# Altium project G100_PTC_RS232_201806.PrjPCB
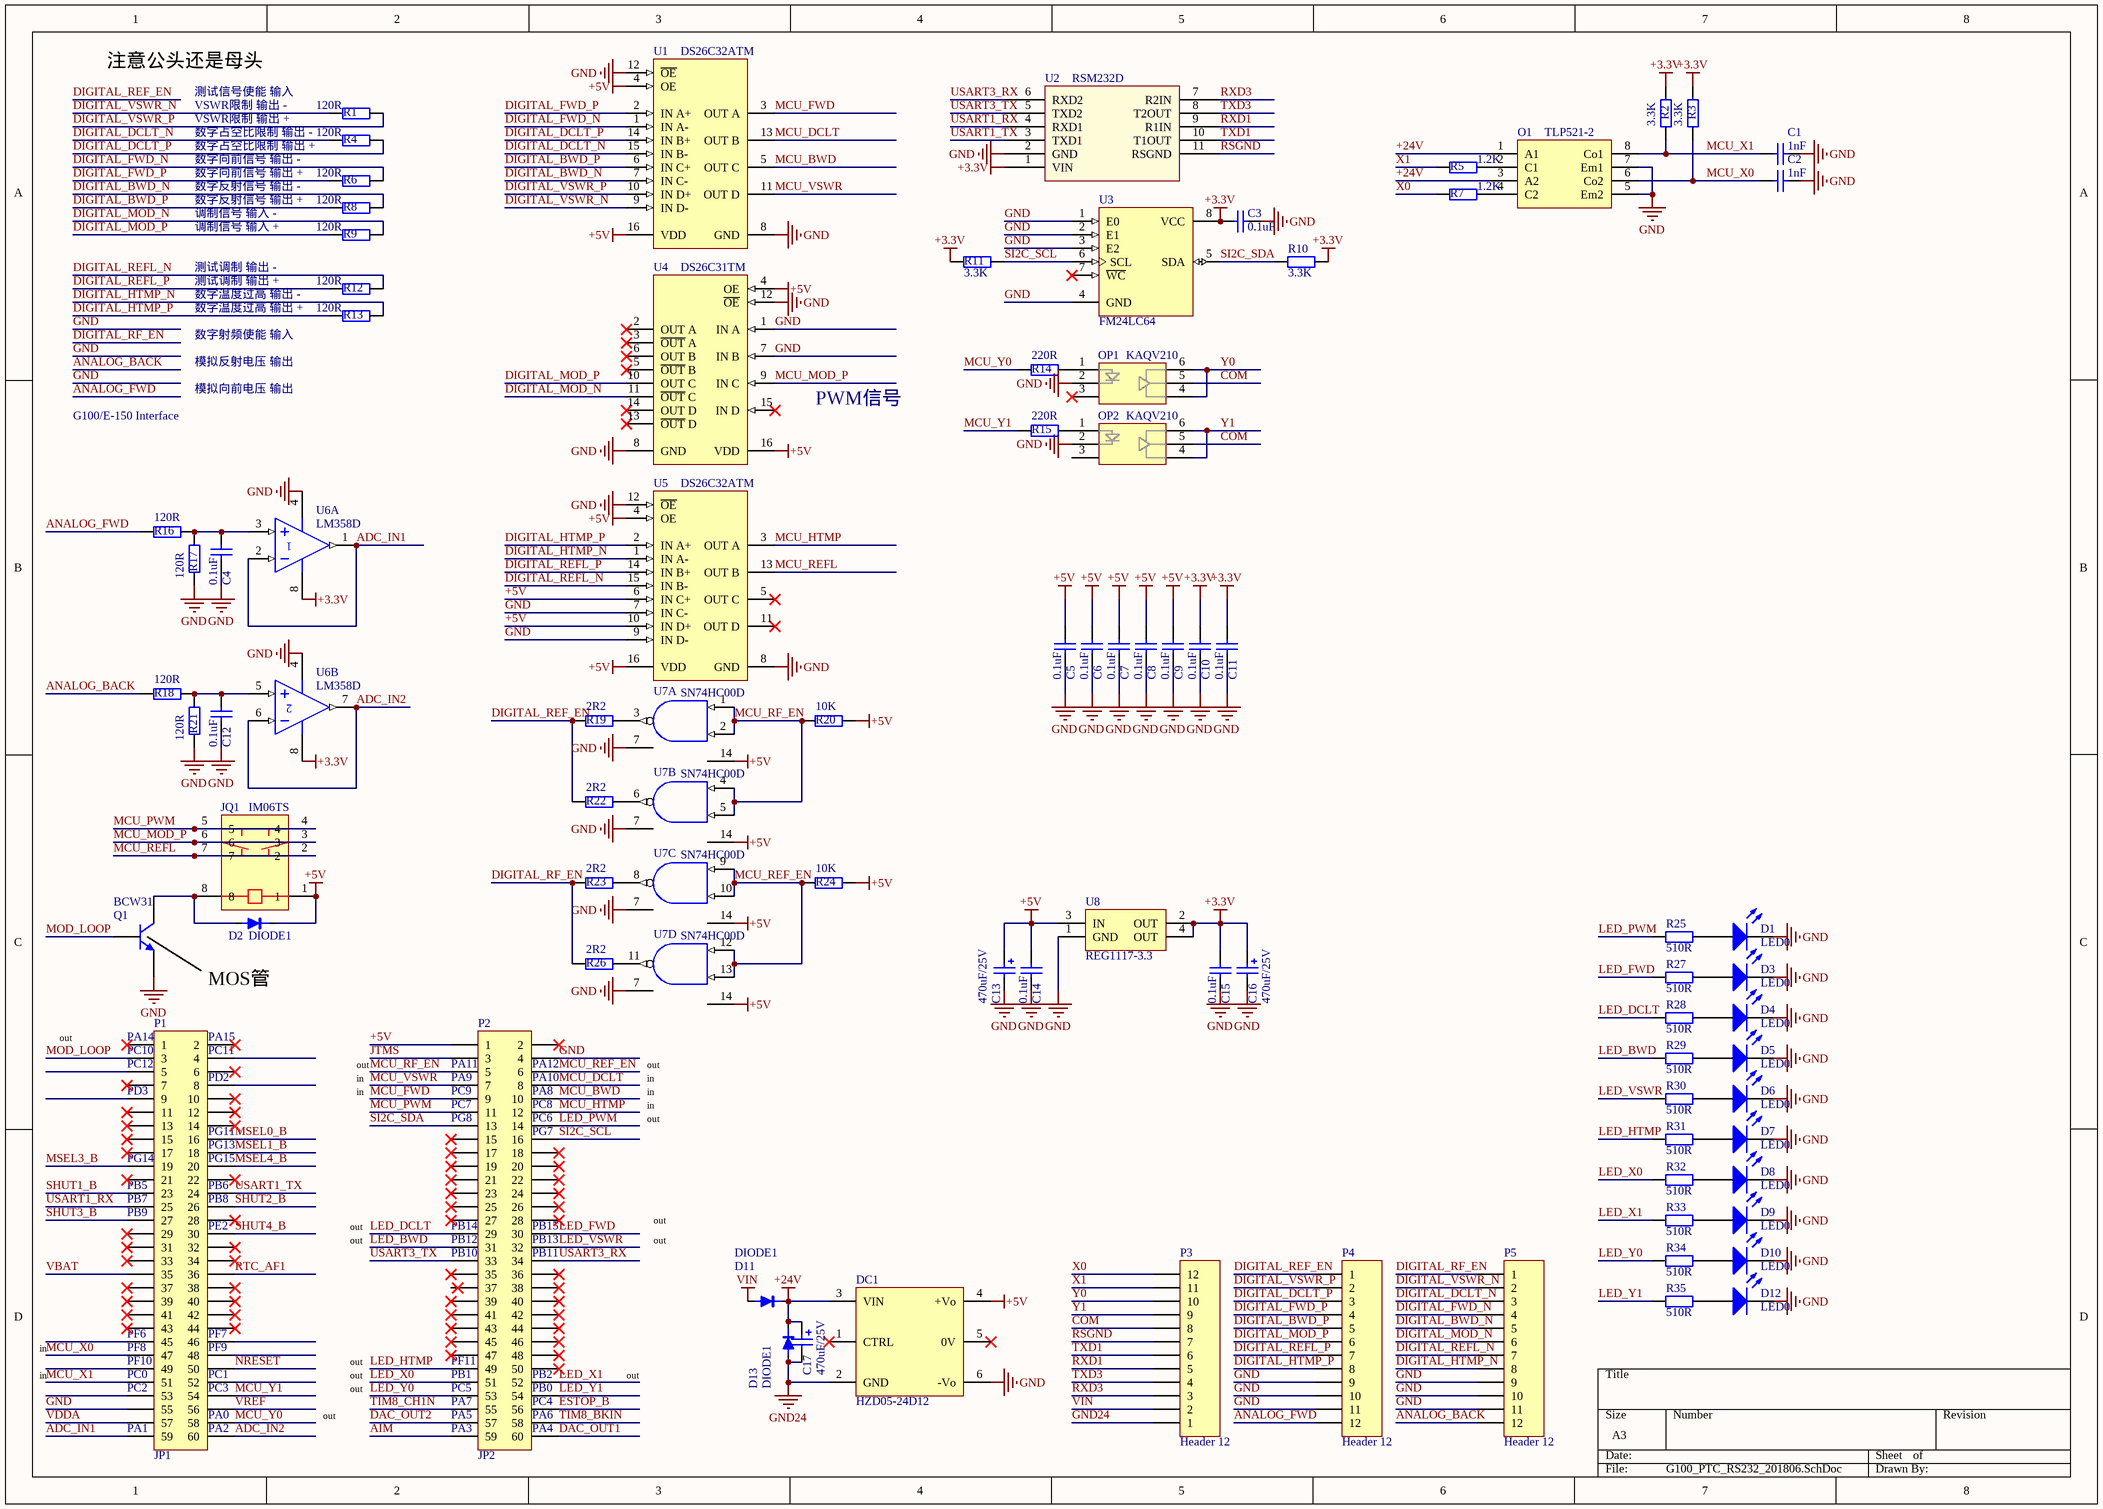
[diagram p0: G100_PTC_RS232_201806.SchDoc]
1 sheet, 84 parts. Net scope: global (net labels, ports and power ports of the same name join across sheets).
Board file: G100_PTC_RS232_201806.PcbDoc

## Sheet G100_PTC_RS232_201806.SchDoc
size A3; PageSetup: Record=PageOptions|CenterHorizontal=True|CenterVertical=True|PrintScale=1.00|XCorrection=1.00|YCorrection=1.00|PrintKind=1|BorderSize=5000000|LeftOffset=0|BottomOffset=0|Orientation=2|PaperLength=1000|PaperWidth=1000|Scale=100|PaperSource=7|PrintQuality=600|MediaType=1|DitherType=10|PaperKind=A3|PrintScaleMode=1

### Parts
C1  1nF  [0805C]
C2  1nF  [0805C]
C3  0.1uF  [0805C]
C4  0.1uF  [0805C]
C5  0.1uF  [0805C]
C6  0.1uF  [0805C]
C7  0.1uF  [0805C]
C8  0.1uF  [0805C]
C9  0.1uF  [0805C]
C10  0.1uF  [0805C]
C11  0.1uF  [0805C]
C12  0.1uF  [0805C]
C13  470uF/25V  [RB3.5-8]
C14  0.1uF  [0805C]
C15  0.1uF  [0805C]
C16  470uF/25V  [RB3.5-8]
C17  470uF/25V  [RB3.5-8]
D1  LED0  [LEDLight]
D2  DIODE1  [SOD123]
D3  LED0  [LEDLight]
D4  LED0  [LEDLight]
D5  LED0  [LEDLight]
D6  LED0  [LEDLight]
D7  LED0  [LEDLight]
D8  LED0  [LEDLight]
D9  LED0  [LEDLight]
D10  LED0  [LEDLight]
D11  DIODE1  [DIODE-DO56]
D12  LED0  [LEDLight]
D13  DIODE1  [DIODE-DO56]
DC1  HZD05-24D12  [HZ03V2]
JQ1  IM06TS  [IM06TS]
O1  TLP521-2  [DIP-8]
OP1  KAQV210  [DIP-6]
OP2  KAQV210  [DIP-6]
P1  JP1  [HDR2X30]
P2  JP2  [HDR2X30]
P3  Header 12  [15EDGVM-3.5-12P-14]
P4  Header 12  [15EDGVM-3.5-12P-14]
P5  Header 12  [15EDGVM-3.5-12P-14]
Q1  BCW31  [SOT-23A]
R1  120R  [0805C]
R2  3.3K  [0805C]
R3  3.3K  [0805C]
R4  120R  [0805C]
R5  1.2K  [6332[2512]]
R6  120R  [0805C]
R7  1.2K  [6332[2512]]
R8  120R  [0805C]
R9  120R  [0805C]
R10  3.3K  [0805C]
R11  3.3K  [0805C]
R12  120R  [0805C]
R13  120R  [0805C]
R14  220R  [0805C]
R15  220R  [0805C]
R16  120R  [0805C]
R17  120R  [0805C]
R18  120R  [0805C]
R19  2R2  [0805C]
R20  10K  [0805C]
R21  120R  [0805C]
R22  2R2  [0805C]
R23  2R2  [0805C]
R24  10K  [0805C]
R25  510R  [0805C]
R26  2R2  [0805C]
R27  510R  [0805C]
R28  510R  [0805C]
R29  510R  [0805C]
R30  510R  [0805C]
R31  510R  [0805C]
R32  510R  [0805C]
R33  510R  [0805C]
R34  510R  [0805C]
R35  510R  [0805C]
U1  DS26C32ATM  [M16A_L]
U2  RSM232D  [CTM-8251D]
U3  FM24LC64  [SOP8_L]
U4  DS26C31TM  [M16A_L]
U5  DS26C32ATM  [M16A_L]
U6  LM358D  [751-02_N]  (parts A,B of 2)
U7  SN74HC00D  [D014_N]  (parts A,B,C,D of 4)
U8  REG1117-3.3  [ZZ311]

### Nets
+3.3V: C3.2 C10.2 C11.2 C15.2 C16.1 R2.2 R3.2 R10.2 R11.2 U2.1(VIN) U3.8(VCC) U6.8(V+) U8.2(OUT) U8.4(OUT)
+5V: C5.2 C6.2 C7.2 C8.2 C9.2 C13.1 C14.2 D2.2(K) DC1.4(+Vo) JQ1.1 P2.1 R20.1 R24.1 U1.4(OE) U1.16(VDD) U4.4(OE) U4.16(VDD) U5.4(OE) U5.6(IN_C+) U5.10(IN_D+) U5.16(VDD) U7.14(VCC) U8.3(IN)  [also labelled VCC]
+24V: C17.1 D11.2(K) D13.2(K) DC1.3(VIN) O1.1(A1) O1.3(A2)
GND: C1.2 C2.2 C3.1 C4.1 C5.1 C6.1 C7.1 C8.1 C9.1 C10.1 C11.1 C12.1 C13.2 C14.1 C15.1 C16.2 D1.2(K) D3.2(K) D4.2(K) D5.2(K) D6.2(K) D7.2(K) D8.2(K) D9.2(K) D10.2(K) D12.2(K) DC1.6(-Vo) O1.5(Em2) O1.7(Em1) OP1.2 OP2.2 P1.55 P2.4 P4.9 P4.10 P4.11 P5.9 P5.10 P5.11 Q1.2(E) R17.2 R21.2 U1.8(GND) U1.12(~{OE}) U2.2(GND) U3.1(E0) U3.2(E1) U3.3(E2) U3.4(GND) U4.1(IN_A) U4.7(IN_B) U4.8(GND) U4.12(~{OE}) U5.7(IN_C-) U5.8(GND) U5.9(IN_D-) U5.12(~{OE}) U6.4(V-) U7.7(GND) U8.1(GND)
GND24: C17.2 D13.1(A) DC1.2(GND) P3.1
VIN: D11.1(A) P3.2
ADC_IN1: P1.59 U6.1(OUT) U6.2(IN-)
ADC_IN2: P1.60 U6.6(IN-) U6.7(OUT)
AIM: P2.59
ANALOG_BACK: P5.12 R18.2
ANALOG_FWD: P4.12 R16.2
COM: OP1.5 OP2.5 P3.8
DAC_OUT1: P2.60
DAC_OUT2: P2.57
DIGITAL_BWD_N: P5.5 R8.1 U1.7(IN_C-)
DIGITAL_BWD_P: P4.5 R8.2 U1.6(IN_C+)
DIGITAL_DCLT_N: P5.3 R4.2 U1.15(IN_B-)
DIGITAL_DCLT_P: P4.3 R4.1 U1.14(IN_B+)
DIGITAL_FWD_N: P5.4 R6.1 U1.1(IN_A-)
DIGITAL_FWD_P: P4.4 R6.2 U1.2(IN_A+)
DIGITAL_HTMP_N: P5.8 R13.1 U5.1(IN_A-)
DIGITAL_HTMP_P: P4.8 R13.2 U5.2(IN_A+)
DIGITAL_MOD_N: P5.6 R9.1 U4.11(~{OUT}_C)
DIGITAL_MOD_P: P4.6 R9.2 U4.10(OUT_C)
DIGITAL_REF_EN: P4.1 R19.2 R22.2
DIGITAL_REFL_N: P5.7 R12.1 U5.15(IN_B-)
DIGITAL_REFL_P: P4.7 R12.2 U5.14(IN_B+)
DIGITAL_RF_EN: P5.1 R23.2 R26.2
DIGITAL_VSWR_N: P5.2 R1.2 U1.9(IN_D-)
DIGITAL_VSWR_P: P4.2 R1.1 U1.10(IN_D+)
ESTOP_B: P2.56
JTMS: P2.3
LED_BWD: P2.31 R29.1
LED_DCLT: P2.29 R28.1
LED_FWD: P2.30 R27.1
LED_HTMP: P2.49 R31.1
LED_PWM: P2.14 R25.1
LED_VSWR: P2.32 R30.1
LED_X0: P2.51 R32.1
LED_X1: P2.52 R33.1
LED_Y0: P2.53 R34.1
LED_Y1: P2.54 R35.1
MCU_BWD: P2.10 U1.5(OUT_C)
MCU_DCLT: P2.8 U1.13(OUT_B)
MCU_FWD: P2.9 U1.3(OUT_A)
MCU_HTMP: P2.12 U5.3(OUT_A)
MCU_MOD_P: JQ1.3 JQ1.6 U4.9(IN_C)
MCU_PWM: JQ1.4 JQ1.5 P2.11
MCU_REF_EN: P2.6 R24.2 U7.9(A) U7.10(B) U7.12(A) U7.13(B)
MCU_REFL: JQ1.2 JQ1.7 U5.13(OUT_B)
MCU_RF_EN: P2.5 R20.2 U7.1(A) U7.2(B) U7.4(A) U7.5(B)
MCU_VSWR: P2.7 U1.11(OUT_D)
MCU_X0: C2.1 O1.6(Co2) P1.47 R3.1
MCU_X1: C1.1 O1.8(Co1) P1.51 R2.1
MCU_Y0: P1.58 R14.2
MCU_Y1: P1.54 R15.2
MOD_LOOP: P1.3 Q1.1(B)
MSEL0_B: P1.16
MSEL1_B: P1.18
MSEL3_B: P1.19
MSEL4_B: P1.20
NRESET: P1.50
RSGND: P3.7 U2.11(RSGND)
RTC_AF1: P1.36
RXD1: P3.5 U2.9(R1IN)
RXD3: P3.3 U2.7(R2IN)
SHUT1_B: P1.23
SHUT2_B: P1.26
SHUT3_B: P1.27
SHUT4_B: P1.30
SI2C_SCL: P2.16 R11.1 U3.6(SCL)
SI2C_SDA: P2.13 R10.1 U3.5(SDA)
TIM8_BKIN: P2.58
TIM8_CH1N: P2.55
TXD1: P3.6 U2.10(T1OUT)
TXD3: P3.4 U2.8(T2OUT)
USART1_RX: P1.25 U2.4(RXD1)
USART1_TX: P1.24 U2.3(TXD1)
USART3_RX: P2.34 U2.6(RXD2)
USART3_TX: P2.33 U2.5(TXD2)
VBAT: P1.35
VDDA: P1.57
VREF: P1.56
X0: P3.12 R7.1
X1: P3.11 R5.1
Y0: OP1.4 OP1.6 P3.10
Y1: OP2.4 OP2.6 P3.9
NetC4_2: C4.2 R16.1 R17.1 U6.3(IN+)
NetC12_2: C12.2 R18.1 R21.1 U6.5(IN+)
NetD1_1: D1.1(A) R25.2
NetD2_1: D2.1(A) JQ1.8 Q1.3(C)
NetD3_1: D3.1(A) R27.2
NetD4_1: D4.1(A) R28.2
NetD5_1: D5.1(A) R29.2
NetD6_1: D6.1(A) R30.2
NetD7_1: D7.1(A) R31.2
NetD8_1: D8.1(A) R32.2
NetD9_1: D9.1(A) R33.2
NetD10_1: D10.1(A) R34.2
NetD12_1: D12.1(A) R35.2
NetO1_2: O1.2(C1) R5.2
NetO1_4: O1.4(C2) R7.2
NetOP1_1: OP1.1 R14.1
NetOP2_1: OP2.1 R15.1
NetR19_1: R19.1 U7.3(Y)
NetR22_1: R22.1 U7.6(Y)
NetR23_1: R23.1 U7.8(Y)
NetR26_1: R26.1 U7.11(Y)

Not connected (* = marked no-connect by the designer): DC1 1(CTRL)* 5(0V)*; OP1 3*; OP2 3; P1 1* 2* 4 5 6* 7* 8 9 10* 11* 12* 13* 14* 15* 17* 21* 22* 28* 29* 31* 32* 33* 34* 37* 38* 39* 40* 41* 42* 43* 44* 45 46 48 49 52 53; P2 2* 15* 17* 18* 19* 20* 21* 22* 23* 24* 25* 26* 27* 28* 35* 36* 37 38* 39* 40* 41* 42* 43* 44* 45* 46* 47* 48* 50*; U3 7(~{WC})*; U4 2(OUT_A)* 3(~{OUT}_A)* 5(~{OUT}_B)* 6(OUT_B)* 13(~{OUT}_D)* 14(OUT_D)* 15(IN_D)*; U5 5(OUT_C)* 11(OUT_D)*

### Notes on the sheet
- 注意公头还是母头
- VSWR限制 输出 -
- 测试信号使能 输入
- 数字向前信号 输出 +
- 数字向前信号 输出 -
- 数字占空比限制 输出 +
- 数字占空比限制 输出 -
- VSWR限制 输出 +
- 调制信号 输入 +
- 调制信号 输入 -
- 数字反射信号 输出 +
- 数字反射信号 输出 -
- 数字温度过高 输出 +
- 数字温度过高 输出 -
- 测试调制 输出 +
- 测试调制 输出 -
- 模拟反射电压 输出
- 数字射频使能 输入
- G100/E-150 Interface
- 模拟向前电压 输出
- PWM信号
- MOS管
- out
- (near P1) PC10
- (near P1) PA14
- (near P1) PC11
- (near P1) PA15
- (near P1) PC12
- (near P1) PD3
- (near P1) PD2
- in
- (near P2) PA9
- (near P2) PC7
- (near P2) PC9
- (near P2) PG8
- (near P2) PA11
- (near P2) PA8
- (near P2) PA10
- (near P2) PC6
- (near P2) PC8
- (near P2) PA12
- (near P1) PG14
- (near P1) PB5
- (near P1) PB6
- (near P1) PG11
- (near P1) PG13
- (near P1) PG15
- (near P2) PG7
- (near P1) PB7
- (near P1) PB9
- (near P1) PB8
- (near P1) PE2
- (near P2) PB14
- (near P2) PB12
- (near P2) PB10
- (near P2) PB13
- (near P2) PB15
- (near P2) PB11
- (near P1) PF6
- (near P1) PF8
- (near P1) PF10
- (near P1) PC0
- (near P1) PC2
- (near P1) PF7
- (near P1) PF9
- (near P1) PC1
- (near P1) PC3
- (near P2) PB1
- (near P2) PC5
- (near P2) PF11
- (near P2) PB0
- (near P2) PB2
- (near P1) PA1
- (near P1) PA0
- (near P1) PA2
- (near P2) PA7
- (near P2) PA5
- (near P2) PA3
- (near P2) PA6
- (near P2) PA4
- (near P2) PC4

### Library data of the parts
C1-C3 = Cap: Capacitor; Value: 100pF; Published: 8-Jun-2000; LatestRevisionDate: 17-Jul-2002; LatestRevisionNote: Re-released for DXP Platform.; PackageReference: RAD-0.3; Publisher: Altium Limited
C4-C12 C14 C15 = Cap: Capacitor; Value: 0.01uF; Published: 8-Jun-2000; LatestRevisionDate: 17-Jul-2002; LatestRevisionNote: Re-released for DXP Platform.; PackageReference: RAD-0.3; Publisher: Altium Limited
C13 C16 C17 = Cap Pol2: Polarized Capacitor (Axial); Value: 100pF; Published: 8-Jun-2000; LatestRevisionDate: 17-Jul-2002; LatestRevisionNote: Re-released for DXP Platform.; PackageReference: POLAR0.8; Publisher: Altium Limited
D1 D3-D10 D12 = LED0: Typical INFRARED GaAs LED; Published: 8-Jun-2000; LatestRevisionDate: 08-Jul-2005; LatestRevisionNote: Mech Layer 1 removed.; PackageReference: LED-0; Publisher: Altium Limited
O1 = TLP521-2: Photocoupler
P1 P2 = Header 30X2: Header, 30-Pin, Dual row; LatestRevisionDate: 17-Jul-2002; LatestRevisionNote: Re-released for DXP Platform.; Publisher: Altium Limited
P3-P5 = Header 12: Header, 12-Pin; LatestRevisionDate: 17-Jul-2002; LatestRevisionNote: Re-released for DXP Platform.; Publisher: Altium Limited
Q1 = BCW31: NPN Epitaxial Silicon Transistor; Published: 8-Jun-2000; LatestRevisionDate: 17-Jul-2002; LatestRevisionNote: Re-released for DXP Platform.; DatasheetDocument: 1999; PackageDocument: Sep-1998; PackageReference: SOT-23A; Publisher: Altium Limited; ComponentLink1Description: Manufacturer Link; ComponentLink1URL: http://www.fairchildsemi.com/; ComponentLink2Description: Datasheet; ComponentLink2URL: http://www.fairchildsemi.com/ds/BC%2FBCW31.pdf
R1-R35 = Res2: Resistor; Value: 1K; Published: 8-Jun-2000; LatestRevisionDate: 17-Jul-2002; LatestRevisionNote: Re-released for DXP Platform.; PackageReference: AXIAL-0.4; Publisher: Altium Limited
U1 U5 = DS26C32ATM: CMOS Quad Differential Line Receiver; Manufacturer: National Semiconductor; CompType: Interface IC; PackageTopMarking: NSUZXYTT*DS26C32ATM; PowerWise: N; Published: 4-Dec-2008; DatasheetVersion: Jun-1998; PackageVersion: revJ, Aug-1995; PackageReference: M16A; Publisher: Altium Limited; PackageDescription: Molded Package, S.O., .150in Wide, 16 Lead; PartNumber: DS26C32ATM; RoHS: O; PinCount: 16; DigiKeyPartNumber: DS26C32ATM-ND; Code_JEDEC: MS-012-AC; Code_IPC: SOIC127P600-16; ComponentLink1Description: DS26C32AT Datasheet; ComponentLink1URL: http://www.national.com/ds/DS/DS26C32AT.pdf; ComponentLink2Description: DS26C32AT Web Page; ComponentLink2URL: http://www.national.com/pf/DS/DS26C32AT.html; ComponentLink3Description: M16A Package Page; ComponentLink3URL: http://www.national.com/packaging/folders/m16a.html
U2 = RSM232D: 双路隔离RS-232收发器
U3 = M24C64MN3: 64 Kbit Serial I²C Bus EEPROM; Published: 24-Aug-2001; LatestRevisionDate: 13-Apr-2006; LatestRevisionNote: IPC-7351 Footprint Added.; DatasheetVersion: Jul-1999; PackageVersion: Jul-1999; PackageReference: SOP8; Publisher: Altium Limited; PackageDescription: 8-Pin Small Outline Integrated Circuit 1.27 mm Pitch; ComponentLink1Description: Manufacturer Link; ComponentLink1URL: http://www.st.com/; ComponentLink2Description: Datasheet; ComponentLink2URL: http://www.st.com/stonline/products/literature/ds/4578/m24c32-w.pdf
U4 = DS26C31TM: CMOS Quad Tri-State Differential Line Driver; Manufacturer: National Semiconductor; CompType: Interface IC; PackageTopMarking: NSUZXYTT*DS26C31TM; PowerWise: N; Published: 4-Dec-2008; DatasheetVersion: Jun-1998; PackageVersion: revJ, Aug-1995; PackageReference: M16A; Publisher: Altium Limited; PackageDescription: Molded Package, S.O., .150in Wide, 16 Lead; PartNumber: DS26C31TM; RoHS: O; PinCount: 16; DigiKeyPartNumber: DS26C31TM-ND; Code_JEDEC: MS-012-AC; Code_IPC: SOIC127P600-16; ComponentLink1Description: DS26C31T Datasheet; ComponentLink1URL: http://www.national.com/ds/DS/DS26C31T.pdf; ComponentLink2Description: DS26C31T Web Page; ComponentLink2URL: http://www.national.com/pf/DS/DS26C31T.html; ComponentLink3Description: M16A Package Page; ComponentLink3URL: http://www.national.com/packaging/folders/m16a.html
U6 = LM358D: Dual Low-Power Operational Amplifier; Published: 17-Jul-2002; LatestRevisionDate: 13-Apr-2006; LatestRevisionNote: IPC-7351 Footprint Added.; DatasheetVersion: 1988; PackageReference: 751-02; Publisher: Altium Limited; PackageDescription: 8-Pin Small Outline Integrated Circuit 1.27 mm Pitch; Code_JEDEC: MS-012-AA; Code_IPC: SOIC127P600-8; ComponentLink1Description: Manufacturer Link; ComponentLink1URL: http://www.onsemi.com/site/products/parametrics/0,4446,251,00.html; ComponentLink2Description: Datasheet; ComponentLink2URL: http://www.onsemi.com/pub/Collateral/LM358-D.PDF
U7 = SN74HC00D: Quadruple 2-Input Positive-NAND Gate; Published: 8-Jun-2000; LatestRevisionDate: 13-Apr-2006; LatestRevisionNote: IPC-7351 Footprint Added.; DatasheetVersion: May-1997; PackageVersion: Jan-1998; PackageReference: D014; Publisher: Altium Limited; PackageDescription: 14-Pin Small Outline Integrated Circuit 1.27 mm Pitch; Code_IPC: SOIC127P600-14; ComponentLink1Description: Manufacturer Link; ComponentLink1URL: http://www.ti.com/; ComponentLink2Description: Datasheet; ComponentLink2URL: http://www-s.ti.com/sc/ds/sn74hc00.pdf
U8 = REG1117-3.3: 800mA and 1A Low Dropout Positive Regulator 2.85V, 3.3V, 5V, and Adjustable; Published: 8-Jun-2000; LatestRevisionDate: 17-Jul-2002; LatestRevisionNote: Re-released for DXP Platform.; DatasheetVersion: Sep-1997; PackageVersion: revC; PackageReference: ZZ311; Publisher: Altium Limited; PackageDescription: SOT-223/SC-73; 4 Leads; Body 6.7 x 7.3 mm, inc. leads (LxW max); ComponentLink1Description: Manufacturer Link; ComponentLink1URL: http://www.ti.com/; ComponentLink2Description: Datasheet; ComponentLink2URL: http://www-s.ti.com/sc/ds/REG1117.pdf